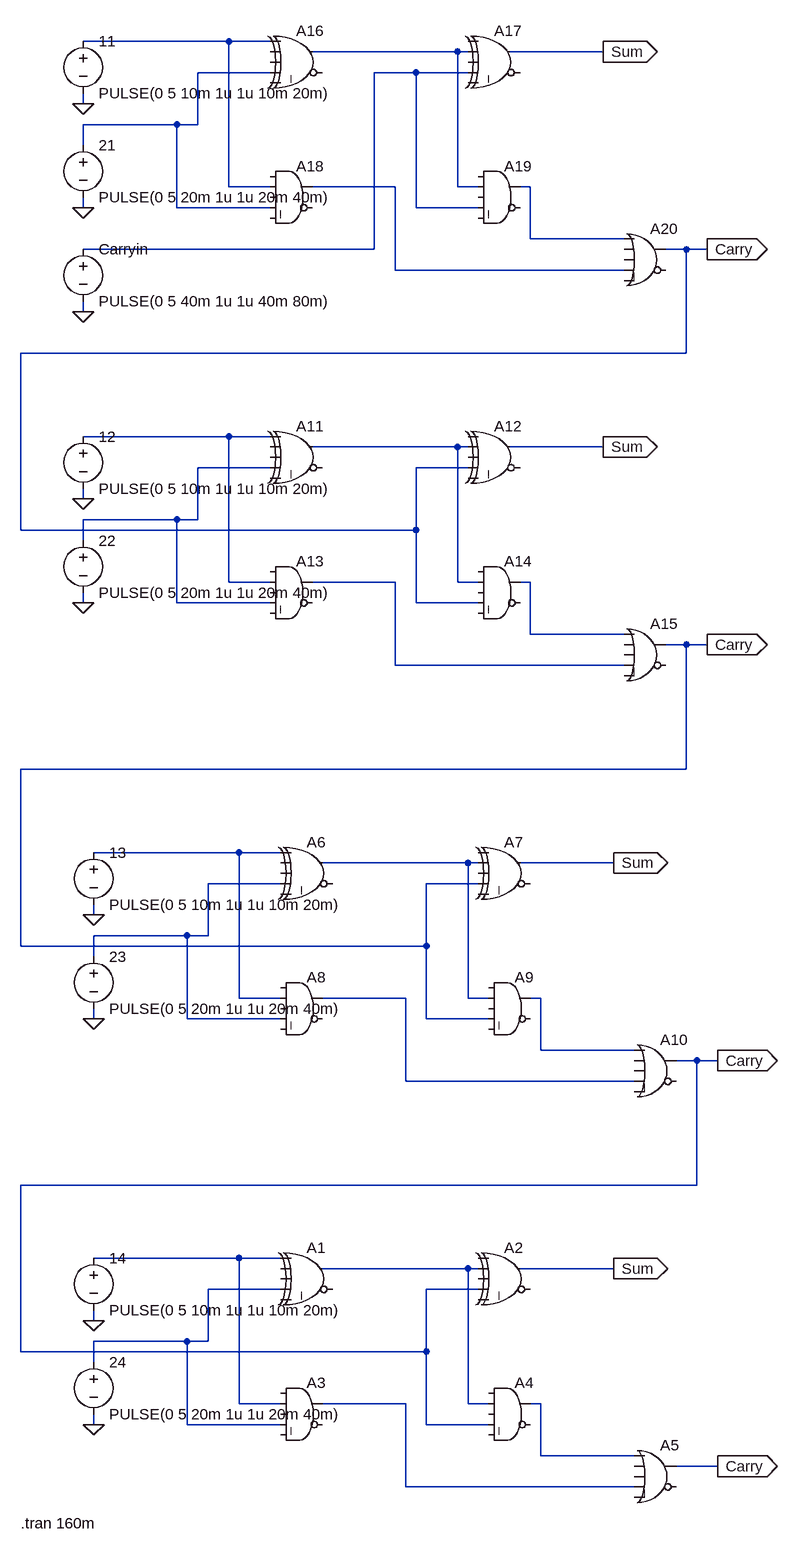
[diagram p0: schematic 8-bit.asc]
8-bit.asc, the LTspice schematic file:
Version 4.1
SHEET 1 880 680
WIRE -176 -2288 -400 -2288
WIRE -112 -2288 -176 -2288
WIRE 176 -2272 -48 -2272
WIRE 192 -2272 176 -2272
WIRE 400 -2272 256 -2272
WIRE -112 -2240 -224 -2240
WIRE 112 -2240 48 -2240
WIRE 192 -2240 112 -2240
WIRE -400 -2192 -400 -2208
WIRE -256 -2160 -400 -2160
WIRE -224 -2160 -224 -2240
WIRE -224 -2160 -256 -2160
WIRE -400 -2128 -400 -2160
WIRE -176 -2064 -176 -2288
WIRE -112 -2064 -176 -2064
WIRE 80 -2064 -48 -2064
WIRE 176 -2064 176 -2272
WIRE 208 -2064 176 -2064
WIRE 288 -2064 272 -2064
WIRE -400 -2032 -400 -2048
WIRE -256 -2032 -256 -2160
WIRE -112 -2032 -256 -2032
WIRE 112 -2032 112 -2240
WIRE 208 -2032 112 -2032
WIRE 288 -1984 288 -2064
WIRE 432 -1984 288 -1984
WIRE 48 -1968 48 -2240
WIRE 48 -1968 -400 -1968
WIRE 528 -1968 496 -1968
WIRE 560 -1968 528 -1968
WIRE 80 -1936 80 -2064
WIRE 432 -1936 80 -1936
WIRE -400 -1872 -400 -1888
WIRE 528 -1808 528 -1968
WIRE 528 -1808 -496 -1808
WIRE -176 -1680 -400 -1680
WIRE -112 -1680 -176 -1680
WIRE 176 -1664 -48 -1664
WIRE 192 -1664 176 -1664
WIRE 400 -1664 256 -1664
WIRE -112 -1632 -224 -1632
WIRE 192 -1632 112 -1632
WIRE -400 -1584 -400 -1600
WIRE -256 -1552 -400 -1552
WIRE -224 -1552 -224 -1632
WIRE -224 -1552 -256 -1552
WIRE -496 -1536 -496 -1808
WIRE 112 -1536 112 -1632
WIRE 112 -1536 -496 -1536
WIRE -400 -1520 -400 -1552
WIRE -176 -1456 -176 -1680
WIRE -112 -1456 -176 -1456
WIRE 80 -1456 -48 -1456
WIRE 176 -1456 176 -1664
WIRE 208 -1456 176 -1456
WIRE 288 -1456 272 -1456
WIRE -400 -1424 -400 -1440
WIRE -256 -1424 -256 -1552
WIRE -112 -1424 -256 -1424
WIRE 112 -1424 112 -1536
WIRE 208 -1424 112 -1424
WIRE 288 -1376 288 -1456
WIRE 432 -1376 288 -1376
WIRE 528 -1360 496 -1360
WIRE 560 -1360 528 -1360
WIRE 80 -1328 80 -1456
WIRE 432 -1328 80 -1328
WIRE 528 -1168 528 -1360
WIRE 528 -1168 -496 -1168
WIRE -160 -1040 -384 -1040
WIRE -96 -1040 -160 -1040
WIRE 192 -1024 -32 -1024
WIRE 208 -1024 192 -1024
WIRE 416 -1024 272 -1024
WIRE -96 -992 -208 -992
WIRE 208 -992 128 -992
WIRE -384 -944 -384 -960
WIRE -240 -912 -384 -912
WIRE -208 -912 -208 -992
WIRE -208 -912 -240 -912
WIRE -496 -896 -496 -1168
WIRE 128 -896 128 -992
WIRE 128 -896 -496 -896
WIRE -384 -880 -384 -912
WIRE -160 -816 -160 -1040
WIRE -96 -816 -160 -816
WIRE 96 -816 -32 -816
WIRE 192 -816 192 -1024
WIRE 224 -816 192 -816
WIRE 304 -816 288 -816
WIRE -384 -784 -384 -800
WIRE -240 -784 -240 -912
WIRE -96 -784 -240 -784
WIRE 128 -784 128 -896
WIRE 224 -784 128 -784
WIRE 304 -736 304 -816
WIRE 448 -736 304 -736
WIRE 544 -720 512 -720
WIRE 576 -720 544 -720
WIRE 96 -688 96 -816
WIRE 448 -688 96 -688
WIRE 544 -528 544 -720
WIRE 544 -528 -496 -528
WIRE -160 -416 -384 -416
WIRE -96 -416 -160 -416
WIRE 192 -400 -32 -400
WIRE 208 -400 192 -400
WIRE 416 -400 272 -400
WIRE -96 -368 -208 -368
WIRE 208 -368 128 -368
WIRE -384 -320 -384 -336
WIRE -240 -288 -384 -288
WIRE -208 -288 -208 -368
WIRE -208 -288 -240 -288
WIRE -496 -272 -496 -528
WIRE 128 -272 128 -368
WIRE 128 -272 -496 -272
WIRE -384 -256 -384 -288
WIRE -160 -192 -160 -416
WIRE -96 -192 -160 -192
WIRE 96 -192 -32 -192
WIRE 192 -192 192 -400
WIRE 224 -192 192 -192
WIRE 304 -192 288 -192
WIRE -384 -160 -384 -176
WIRE -240 -160 -240 -288
WIRE -96 -160 -240 -160
WIRE 128 -160 128 -272
WIRE 224 -160 128 -160
WIRE 304 -112 304 -192
WIRE 448 -112 304 -112
WIRE 576 -96 512 -96
WIRE 96 -64 96 -192
WIRE 448 -64 96 -64
FLAG -384 -320 0
FLAG -384 -160 0
FLAG 416 -400 Sum
IOPIN 416 -400 Out
FLAG 576 -96 Carry
IOPIN 576 -96 Out
FLAG -384 -944 0
FLAG -384 -784 0
FLAG 416 -1024 Sum
IOPIN 416 -1024 Out
FLAG 576 -720 Carry
IOPIN 576 -720 Out
FLAG -400 -1584 0
FLAG -400 -1424 0
FLAG 400 -1664 Sum
IOPIN 400 -1664 Out
FLAG 560 -1360 Carry
IOPIN 560 -1360 Out
FLAG -400 -2192 0
FLAG -400 -2032 0
FLAG -400 -1872 0
FLAG 400 -2272 Sum
IOPIN 400 -2272 Out
FLAG 560 -1968 Carry
IOPIN 560 -1968 Out
SYMBOL voltage -384 -432 R0
WINDOW 123 0 0 Left 0
WINDOW 39 0 0 Left 0
SYMATTR InstName 14
SYMATTR Value PULSE(0 5 10m 1u 1u 10m 20m)
SYMBOL voltage -384 -272 R0
WINDOW 123 0 0 Left 0
WINDOW 39 0 0 Left 0
SYMATTR InstName 24
SYMATTR Value PULSE(0 5 20m 1u 1u 20m 40m)
SYMBOL Digital\\xor -48 -448 R0
SYMATTR InstName A1
SYMBOL Digital\\xor 256 -448 R0
SYMATTR InstName A2
SYMBOL Digital\\and -64 -240 R0
SYMATTR InstName A3
SYMBOL Digital\\and 256 -240 R0
SYMATTR InstName A4
SYMBOL Digital\\or 480 -144 R0
SYMATTR InstName A5
SYMBOL voltage -384 -1056 R0
WINDOW 123 0 0 Left 0
WINDOW 39 0 0 Left 0
SYMATTR InstName 13
SYMATTR Value PULSE(0 5 10m 1u 1u 10m 20m)
SYMBOL voltage -384 -896 R0
WINDOW 123 0 0 Left 0
WINDOW 39 0 0 Left 0
SYMATTR InstName 23
SYMATTR Value PULSE(0 5 20m 1u 1u 20m 40m)
SYMBOL Digital\\xor -48 -1072 R0
SYMATTR InstName A6
SYMBOL Digital\\xor 256 -1072 R0
SYMATTR InstName A7
SYMBOL Digital\\and -64 -864 R0
SYMATTR InstName A8
SYMBOL Digital\\and 256 -864 R0
SYMATTR InstName A9
SYMBOL Digital\\or 480 -768 R0
SYMATTR InstName A10
SYMBOL voltage -400 -1696 R0
WINDOW 123 0 0 Left 0
WINDOW 39 0 0 Left 0
SYMATTR InstName 12
SYMATTR Value PULSE(0 5 10m 1u 1u 10m 20m)
SYMBOL voltage -400 -1536 R0
WINDOW 123 0 0 Left 0
WINDOW 39 0 0 Left 0
SYMATTR InstName 22
SYMATTR Value PULSE(0 5 20m 1u 1u 20m 40m)
SYMBOL Digital\\xor -64 -1712 R0
SYMATTR InstName A11
SYMBOL Digital\\xor 240 -1712 R0
SYMATTR InstName A12
SYMBOL Digital\\and -80 -1504 R0
SYMATTR InstName A13
SYMBOL Digital\\and 240 -1504 R0
SYMATTR InstName A14
SYMBOL Digital\\or 464 -1408 R0
SYMATTR InstName A15
SYMBOL voltage -400 -2304 R0
WINDOW 123 0 0 Left 0
WINDOW 39 0 0 Left 0
SYMATTR InstName 11
SYMATTR Value PULSE(0 5 10m 1u 1u 10m 20m)
SYMBOL voltage -400 -2144 R0
WINDOW 123 0 0 Left 0
WINDOW 39 0 0 Left 0
SYMATTR InstName 21
SYMATTR Value PULSE(0 5 20m 1u 1u 20m 40m)
SYMBOL voltage -400 -1984 R0
WINDOW 123 0 0 Left 0
WINDOW 39 0 0 Left 0
SYMATTR InstName Carryin
SYMATTR Value PULSE(0 5 40m 1u 1u 40m 80m)
SYMBOL Digital\\xor -64 -2320 R0
SYMATTR InstName A16
SYMBOL Digital\\xor 240 -2320 R0
SYMATTR InstName A17
SYMBOL Digital\\and -80 -2112 R0
SYMATTR InstName A18
SYMBOL Digital\\and 240 -2112 R0
SYMATTR InstName A19
SYMBOL Digital\\or 464 -2016 R0
SYMATTR InstName A20
TEXT -496 -8 Left 2 !.tran 160m

The netlist it stands for:
* 8-bit.asc
V§14 N017 0 PULSE(0 5 10m 1u 1u 10m 20m)
V§24 N019 0 PULSE(0 5 20m 1u 1u 20m 40m)
A1 N017 0 0 N019 0 0 N018 0 XOR
A2 0 N018 0 Carry 0 0 Sum 0 XOR
A3 0 N017 0 N019 0 0 N020 0 AND
A4 0 N018 0 Carry 0 0 N021 0 AND
A5 N021 0 0 N020 0 0 Carry 0 OR
V§13 N012 0 PULSE(0 5 10m 1u 1u 10m 20m)
V§23 N014 0 PULSE(0 5 20m 1u 1u 20m 40m)
A6 N012 0 0 N014 0 0 N013 0 XOR
A7 0 N013 0 Carry 0 0 Sum 0 XOR
A8 0 N012 0 N014 0 0 N015 0 AND
A9 0 N013 0 Carry 0 0 N016 0 AND
A10 N016 0 0 N015 0 0 Carry 0 OR
V§12 N007 0 PULSE(0 5 10m 1u 1u 10m 20m)
V§22 N009 0 PULSE(0 5 20m 1u 1u 20m 40m)
A11 N007 0 0 N009 0 0 N008 0 XOR
A12 0 N008 0 Carry 0 0 Sum 0 XOR
A13 0 N007 0 N009 0 0 N010 0 AND
A14 0 N008 0 Carry 0 0 N011 0 AND
A15 N011 0 0 N010 0 0 Carry 0 OR
V§11 N001 0 PULSE(0 5 10m 1u 1u 10m 20m)
V§21 N003 0 PULSE(0 5 20m 1u 1u 20m 40m)
V§Carryin N004 0 PULSE(0 5 40m 1u 1u 40m 80m)
A16 N001 0 0 N003 0 0 N002 0 XOR
A17 0 N002 0 N004 0 0 Sum 0 XOR
A18 0 N001 0 N003 0 0 N005 0 AND
A19 0 N002 0 N004 0 0 N006 0 AND
A20 N006 0 0 N005 0 0 Carry 0 OR
.tran 160m
.backanno
.end